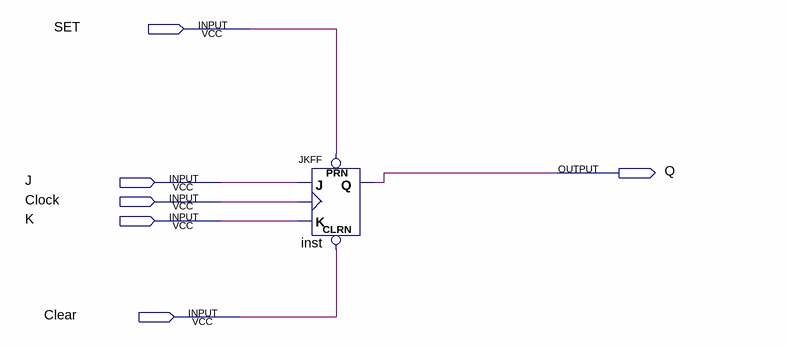
[diagram p0: schematic sheet]
// Quartus schematic JKffValidation.bdf as structural Verilog: 1 symbols, 6 pins
module JKffValidation (
  input  SET,
  input  J,
  input  Clock,
  input  K,
  input  Clear,
  output Q
);

  JKFF inst (.PRN(SET), .CLRN(Clear), .K(K), .J(J), .CLK(Clock), .Q(Q));
endmodule
